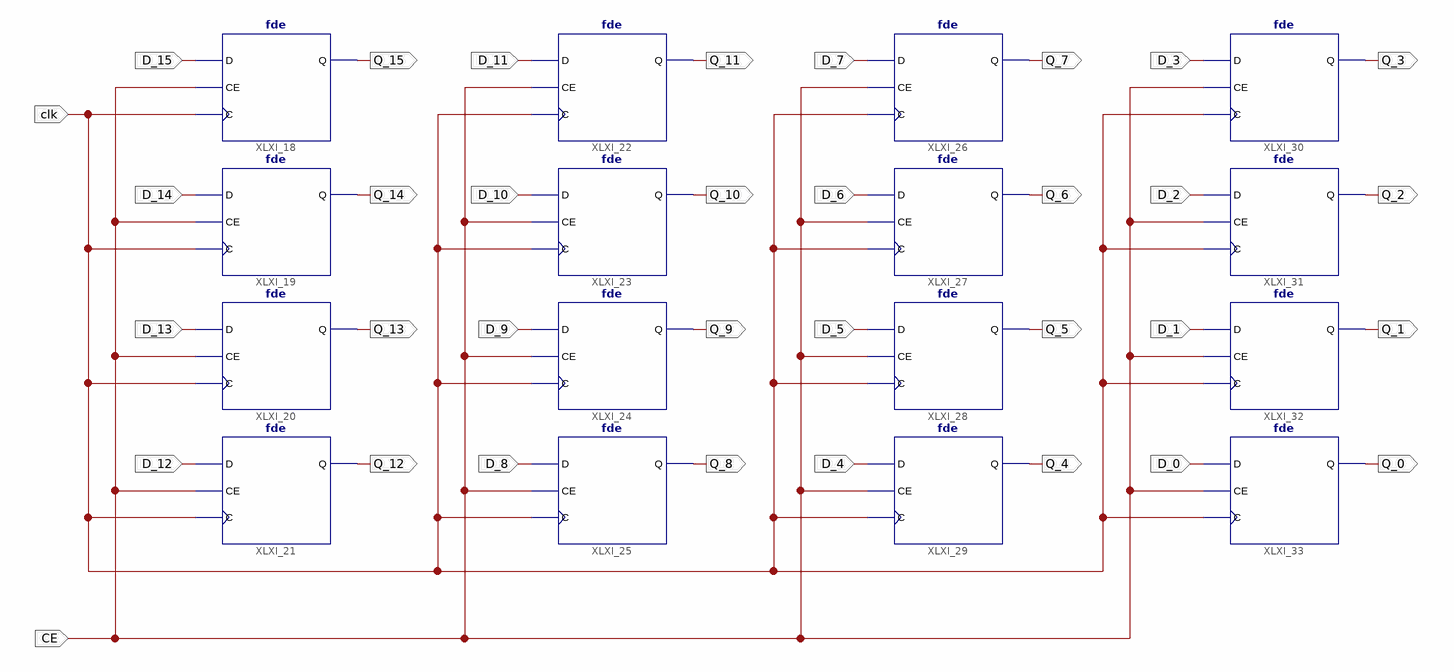
[diagram p0: schematic sheet 1]
// Xilinx ISE schematic DFF_Reg_16bits.sch (virtex6) as structural Verilog: 16 symbols, 34 ports
module DFF_Reg_16bits (
  input  D_15,
  input  D_14,
  input  D_13,
  input  D_12,
  input  D_11,
  input  D_10,
  input  D_9,
  input  D_8,
  input  D_7,
  input  D_6,
  input  D_5,
  input  D_4,
  input  clk,
  input  D_3,
  input  D_2,
  input  D_1,
  input  D_0,
  input  CE,
  output Q_15,
  output Q_14,
  output Q_13,
  output Q_12,
  output Q_3,
  output Q_2,
  output Q_1,
  output Q_0,
  output Q_8,
  output Q_9,
  output Q_10,
  output Q_11,
  output Q_4,
  output Q_5,
  output Q_6,
  output Q_7
);

  fde XLXI_18 (.C(clk), .CE(CE), .D(D_15), .Q(Q_15));
  fde XLXI_19 (.C(clk), .CE(CE), .D(D_14), .Q(Q_14));
  fde XLXI_20 (.C(clk), .CE(CE), .D(D_13), .Q(Q_13));
  fde XLXI_21 (.C(clk), .CE(CE), .D(D_12), .Q(Q_12));
  fde XLXI_22 (.C(clk), .CE(CE), .D(D_11), .Q(Q_11));
  fde XLXI_23 (.C(clk), .CE(CE), .D(D_10), .Q(Q_10));
  fde XLXI_24 (.C(clk), .CE(CE), .D(D_9), .Q(Q_9));
  fde XLXI_25 (.C(clk), .CE(CE), .D(D_8), .Q(Q_8));
  fde XLXI_26 (.C(clk), .CE(CE), .D(D_7), .Q(Q_7));
  fde XLXI_27 (.C(clk), .CE(CE), .D(D_6), .Q(Q_6));
  fde XLXI_28 (.C(clk), .CE(CE), .D(D_5), .Q(Q_5));
  fde XLXI_29 (.C(clk), .CE(CE), .D(D_4), .Q(Q_4));
  fde XLXI_30 (.C(clk), .CE(CE), .D(D_3), .Q(Q_3));
  fde XLXI_31 (.C(clk), .CE(CE), .D(D_2), .Q(Q_2));
  fde XLXI_32 (.C(clk), .CE(CE), .D(D_1), .Q(Q_1));
  fde XLXI_33 (.C(clk), .CE(CE), .D(D_0), .Q(Q_0));
endmodule
